# EAGLE design controller (EAGLE 9.1.2)
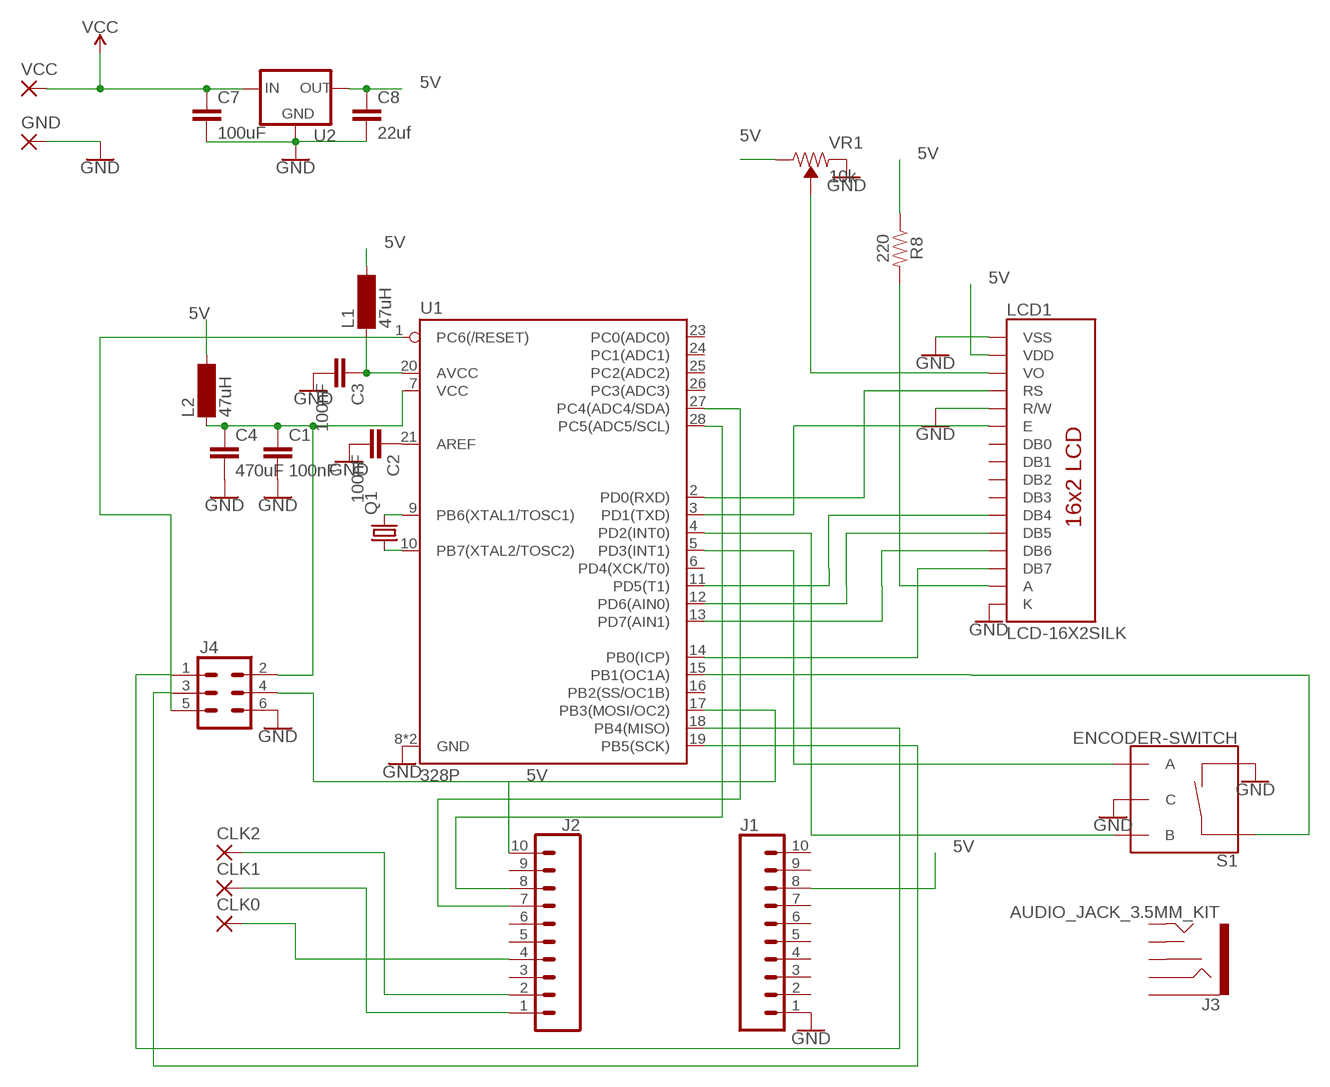
[diagram p0: schematic, sheet 1]

## Parts
C1  100nF  C5/3.5  [C5B3.5]
C2  100nF  C5/3.5  [C5B3.5]
C3  100nF  C5/3.5  [C5B3.5]
C4  470uF  C5/3.5  [C5B3.5]
C7  100uF  C5/3.5  [C5B3.5]
C8  22uf  C5/3.5  [C5B3.5]
CLK0  3,17/1,1  [3,17/1,1]
CLK1  3,17/1,1  [3,17/1,1]
CLK2  3,17/1,1  [3,17/1,1]
GND  3,17/1,1  [3,17/1,1]
J1  CONN_10NO_SILK_PTH_FEMALE  [1X10_NO_SILK]
J2  CONN_10NO_SILK_PTH_FEMALE  [1X10_NO_SILK]
J3  AUDIO_JACK_3.5MM_KIT  [AUDIO-JACK-KIT]
J4  CONN_03X2NO_SILK  [2X3-NS]
L1  47uH  BS75  [BS75]
L2  47uH  BS75  [BS75]
LCD1  LCD-16X2SILK  [LCD-16X2]
Q1  CRYTALHC49S  [HC49/S]
R8  220  1KOHM-HORIZ-1/4W-1%  [AXIAL-0.3]
S1  ENCODER-SWITCH  [ROTARY_ENC_PLAIN]
U1  328P  ATMEGA328P_PDIP  [DIP28]
U2  V_REG_78XXSINK  [TO220-IGO]
VCC  3,17/1,1  [3,17/1,1]
VR1  10k  TRIMPOT-PTH-10MM-KNOB-1/2W-10%  [TRIMPOT-PTH-3386U]

## Nets
5V: C8.1 J1.8 J2.10 L1.2 L2.2 LCD1.2(VDD) R8.P$1 U2.OUT VR1.3(CW)
GND: C1.2 C2.2 C3.2 C4.2 C7.2 C8.2 GND.1(P) J1.1 J4.6 LCD1.1(VSS) LCD1.5(R/W) LCD1.16(K) S1.C S1.SW- U1.8(GND) U1.22(GND) U2.GND VR1.1(CCW)
N$1: C2.1 U1.21(AREF)
N$2: Q1.2 U1.9(PB6(XTAL1/TOSC1))
N$3: Q1.1 U1.10(PB7(XTAL2/TOSC2))
N$4: C1.1 C4.1 J4.2 L2.1 U1.7(VCC)
N$5: LCD1.14(DB7) U1.14(PB0(ICP))
N$6: LCD1.13(DB6) U1.13(PD7(AIN1))
N$7: S1.SW+ U1.15(PB1(OC1A))
N$8: LCD1.4(RS) U1.2(PD0(RXD))
N$9: LCD1.12(DB5) U1.12(PD6(AIN0))
N$10: LCD1.11(DB4) U1.11(PD5(T1))
N$11: LCD1.3(VO) VR1.2(WIPER)
N$12: LCD1.15(A) R8.P$2
N$13: CLK1.1(P) J2.1
N$14: CLK2.1(P) J2.2
N$15: CLK0.1(P) J2.4
N$16: J2.8 U1.28(PC5(ADC5/SCL))
N$17: J2.7 U1.27(PC4(ADC4/SDA))
N$18: S1.A U1.5(PD3(INT1))
N$19: S1.B U1.4(PD2(INT0))
N$20: LCD1.6(E) U1.3(PD1(TXD))
N$21: C3.1 L1.1 U1.20(AVCC)
N$22: J4.4 U1.17(PB3(MOSI/OC2))
N$23: J4.1 U1.18(PB4(MISO))
N$24: J4.3 U1.19(PB5(SCK))
N$25: J4.5 U1.1(PC6(/RESET))
VCC: C7.1 U2.IN VCC.1(P)
Unconnected: J1.2 J1.3 J1.4 J1.5 J1.6 J1.7 J1.9 J1.10 J2.3 J2.5 J2.6 J2.9 J3.RING J3.RSH J3.SLEEVE J3.TIP J3.TSH LCD1.7(DB0) LCD1.8(DB1) LCD1.9(DB2) LCD1.10(DB3) U1.6(PD4(XCK/T0)) U1.16(PB2(SS/OC1B)) U1.23(PC0(ADC0)) U1.24(PC1(ADC1)) U1.25(PC2(ADC2)) U1.26(PC3(ADC3))

## Library data of the parts
C1-C4 C7 C8 = capacitor-wima:C: CAPACITOR naming: grid - package width
CLK0 CLK1 CLK2 GND VCC = wirepad:3,17/1,1: THROUGH-HOLE PAD
J1 J2 = SparkFun-Connectors:CONN_10: Multi connection point. Often used as Generic Header-pin footprint for 0.1 inch spaced/style header connections On any of the 0.1 inch spaced packages, you can populate with these: Break Away Headers - Straight <https://www.sparkfun.com/products/116> (PRT-00116) Break Away Male Headers - Right Angle <https://www.sparkfun.com/products/553> (PRT-00553) Female Headers <https://www.sparkfun.com/products/115> (PRT-00115) Break Away Headers - Machine Pin <https://www.sparkfun.com/products/117> (PRT-00117) Break Away Female Headers - Swiss Machine Pin <https://www.sparkfun.com/products/743> (PRT-00743) Arduino Stackable Header - 10 Pin <https://www.sparkfun.com/products/11376> (PRT-11376) For SCREWTERMINALS and SPRING TERMINALS visit here: Screw Terimnals on SparkFun.com <https://www.sparkfun.com/search/results?term=Screw+Terminals> (5mm/3.5mm/2.54mm spacing) This device is also useful as a general connection point to wire up your design to another part of your project. Our various solder wires solder well into these plated through hole pads. Hook-Up Wire - Assortment (Stranded, 22 AWG) <https://www.sparkfun.com/products/11375> (PRT-11375) Hook-Up Wire - Assortment (Solid Core, 22 AWG) <https://www.sparkfun.com/products/11367> (PRT-11367) View the entire wire category on our website here <https://www.sparkfun.com/categories/141> Special notes: Molex polarized connector foot print use with SKU : PRT-08231 with associated crimp pins and housings. 1MM SMD Version SKU: PRT-10208 NOTES ON THE VARIANTS LOCK and LOCK_LONGPADS... This footprint was designed to help hold the alignment of a through-hole component (i.e. 6-pin header) while soldering it into place. You may notice that each hole has been shifted either up or down by 0.005 of an inch from it's more standard position (which is a perfectly straight line). This slight alteration caused the pins (the squares in the middle) to touch the edges of the holes. Because they are alternating, it causes a "brace" to hold the component in place. 0.005 has proven to be the perfect amount of "off-center" position when using our standard breakaway headers. Although looks a little odd when you look at the bare footprint, once you have a header in there, the alteration is very hard to notice. Also,if you push a header all the way into place, it is covered up entirely on the bottom side.; PROD_ID: CONN-11563
J3 = SparkFun-Connectors:AUDIO_JACK_3.5MM: Audio Jack 3.5mm variants of PTH and SMT stereo audio jack with bypass switches. SparkFun Products: SparkFun SparkPunk Sound Kit <[https://www.sparkfun.com/products/11177]> - PTH MP3 Trigger <https://www.sparkfun.com/products/13720> -3.5mm SMD SparkFun PicoBoard <https://www.sparkfun.com/products/11888>- 2.5mm SMD; PROD_ID: CONN-08774; SF_ID: PRT-08032
J4 = SparkFun-Connectors:CONN_03X2: Multi connection point. Often used as Generic Header-pin footprint for 0.1 inch spaced/style header connections You can populate with any combo of single row headers, but if you'd like an exact match, check these: Header - 2x3 (Male, 0.1") <https://www.sparkfun.com/products/12807> (PRT-12807) Header - 2x3 (Female, 0.1") <https://www.sparkfun.com/products/13010> (PRT-13010) 2x3 Pin Shrouded Header <https://www.sparkfun.com/products/10877> (PRT-10877) On any of the 0.1 inch spaced packages, you can populate with these: Break Away Headers - Straight <https://www.sparkfun.com/products/116> (PRT-00116) Break Away Male Headers - Right Angle <https://www.sparkfun.com/products/553> (PRT-00553) Female Headers <https://www.sparkfun.com/products/115> (PRT-00115) Break Away Headers - Machine Pin <https://www.sparkfun.com/products/117> (PRT-00117) Break Away Female Headers - Swiss Machine Pin <https://www.sparkfun.com/products/743> (PRT-00743) Special note: the shrouded connector mates well with our 3x2 ribbon cables: Ribbon Crimp Connector - 6-pin (2x3, Female) <https://www.sparkfun.com/products/10651> (PRT-10651) Ribbon Cable - 6 wire (15ft) <https://www.sparkfun.com/products/10646> (PRT-10646)
L1 L2 = inductor-neosid:BS: INDUCTOR nominal inductance, magnetically screened; OC_FARNELL: unknown; OC_NEWARK: unknown
LCD1 = SparkFun-Displays:LCD-16X2: Standard text-only 16x2 parallel input LCD Basic 16 character by 2 line display. Typically utilizes the extremely common HD44780 parallel interface chipset SparkFun Products: Basic 16x2 Green <https://www.sparkfun.com/products/255> Basic 8x2 Green <https://www.sparkfun.com/products/11122>; SF_ID: LCD-00255
Q1 = crystal:CRYTAL: CRYSTAL
R8 = SparkFun-Resistors:1KOHM: 1kΩ resistor A resistor is a passive two-terminal electrical component that implements electrical resistance as a circuit element. Resistors act to reduce current flow, and, at the same time, act to lower voltage levels within circuits. - Wikipedia; PROD_ID: RES-12182; VALUE: 1k
S1 = SparkFun-Switches:ENCODER-SWITCH: Rotary Encoder w/ Select Switch Encoders rotate similarly to potentiometers, but they’re different from potentiometers in that an encoder has full rotation without limits. They output gray code so that you can tell how much and in which direction the encoder has been turned. This encoder includes a push-down select switch built into the shaft. SparkFun Products Rotary Encoder <https://www.sparkfun.com/products/9117> (COM-09117); SF_SKU: COM-09117
U1 = SparkFun-IC-Microcontroller:ATMEGA328P_PDIP: Atmel 328P Through hole ATMEGA328P uC used in the Arduino 32kb flash, 1k EEPROM, 2k SRAM Datasheet <http://www.sparkfun.com/datasheets/Components/SMD/ATMega328.pdf> SparkFun Products Storefront component: AVR 28 Pin 20MHz 32K 6A/D - ATMega328P <https://www.sparkfun.com/products/9061> (COM-09061) SparkFun Simon Says - Through-Hole Soldering Kit <https://www.sparkfun.com/products/10547> (KIT-10547) SparkFun Learn to Solder - Simon Says <https://www.sparkfun.com/products/13708> (KIT-13708) SparkFun BigTime Watch Kit <https://www.sparkfun.com/products/11734> (KIT-11734) SparkFun ClockIt <https://www.sparkfun.com/products/10930> (KIT-10930) SparkFun Serial Enabled LCD Kit <https://www.sparkfun.com/products/10097> (LCD-10097) SparkFun Simon Tilts - Through Hole Soldering Kit <https://www.sparkfun.com/products/12634> (KIT-12634) SparkFun Frequency Counter Kit <https://www.sparkfun.com/products/10140> (KIT-10140) FabFM Radio Kit <https://www.sparkfun.com/products/11043> (KIT-11043) SparkFun Binary Blaster Kit <https://www.sparkfun.com/products/12037> (KIT-12037) SparkFun Metro-Gnome <https://www.sparkfun.com/products/9236> (KIT-09236) ATmega328 with Arduino Optiboot (Uno) <https://www.sparkfun.com/products/10524> (DEV-10524); PROD_ID: IC-09136
U2 = SparkFun-IC-Power:V_REG_78XX: Voltage Regulator Standard 78xx regulator. IGO (Input Ground Output). Spark Fun Electronics SKU : COM-00107
VR1 = SparkFun-Resistors:TRIMPOT: Trimming Potentiometer (Trimpot) Three-terminal potentiometers, with an adjustable wiper and two adjustable resistors. A pot can be used to create a configurable voltage divider, or as a variable resistor. "Trimpots" are a subset of potentiometers, usually intended for "set-and-forget" applications. They're often more delicate than standard potentiometers - rated for fewer turns. Variants PTH-KNOB - PTH Trimpot w/ finger-adjustable knob Trimpot 10K with Knob <https://www.sparkfun.com/products/9806> (COM-09806) Datasheet <http://www.sparkfun.com/datasheets/Components/General/TSR-3386.pdf> SMD-3MM-CLOSED-FRAME - SMD 3mm Square Closed-Frame Trimpot Used on e.g. EasyDriver - Stepper Motor Driver <https://www.sparkfun.com/products/12779> Datasheet <http://www.bitechnologies.com/pdfs/22.pdf> (22AR10KTR) SMD-5MM - SMD 5mm Square Closed-Frame Trimpot Used on e.g. IOIO-OTG - V2.2 <https://www.sparkfun.com/products/13613> Datasheet <http://www.vishay.com/docs/51008/ts53.pdf> (TS53YL502MR10) SMD-3MM-1/10W-25% - 3mm Square Open-Frame Trimpot Used on e.g. SparkFun Shapeoko <https://www.sparkfun.com/products/13899> Datasheet <http://www.bourns.com/docs/Product-Datasheets/TC33.pdf> (TC33X-2-103E); PROD_ID: RES-09730; SF_SKU: COM-09806

## Net classes
0 default: width 0.762 mm, drill 0.762 mm, clearance 0.508 mm

## Board
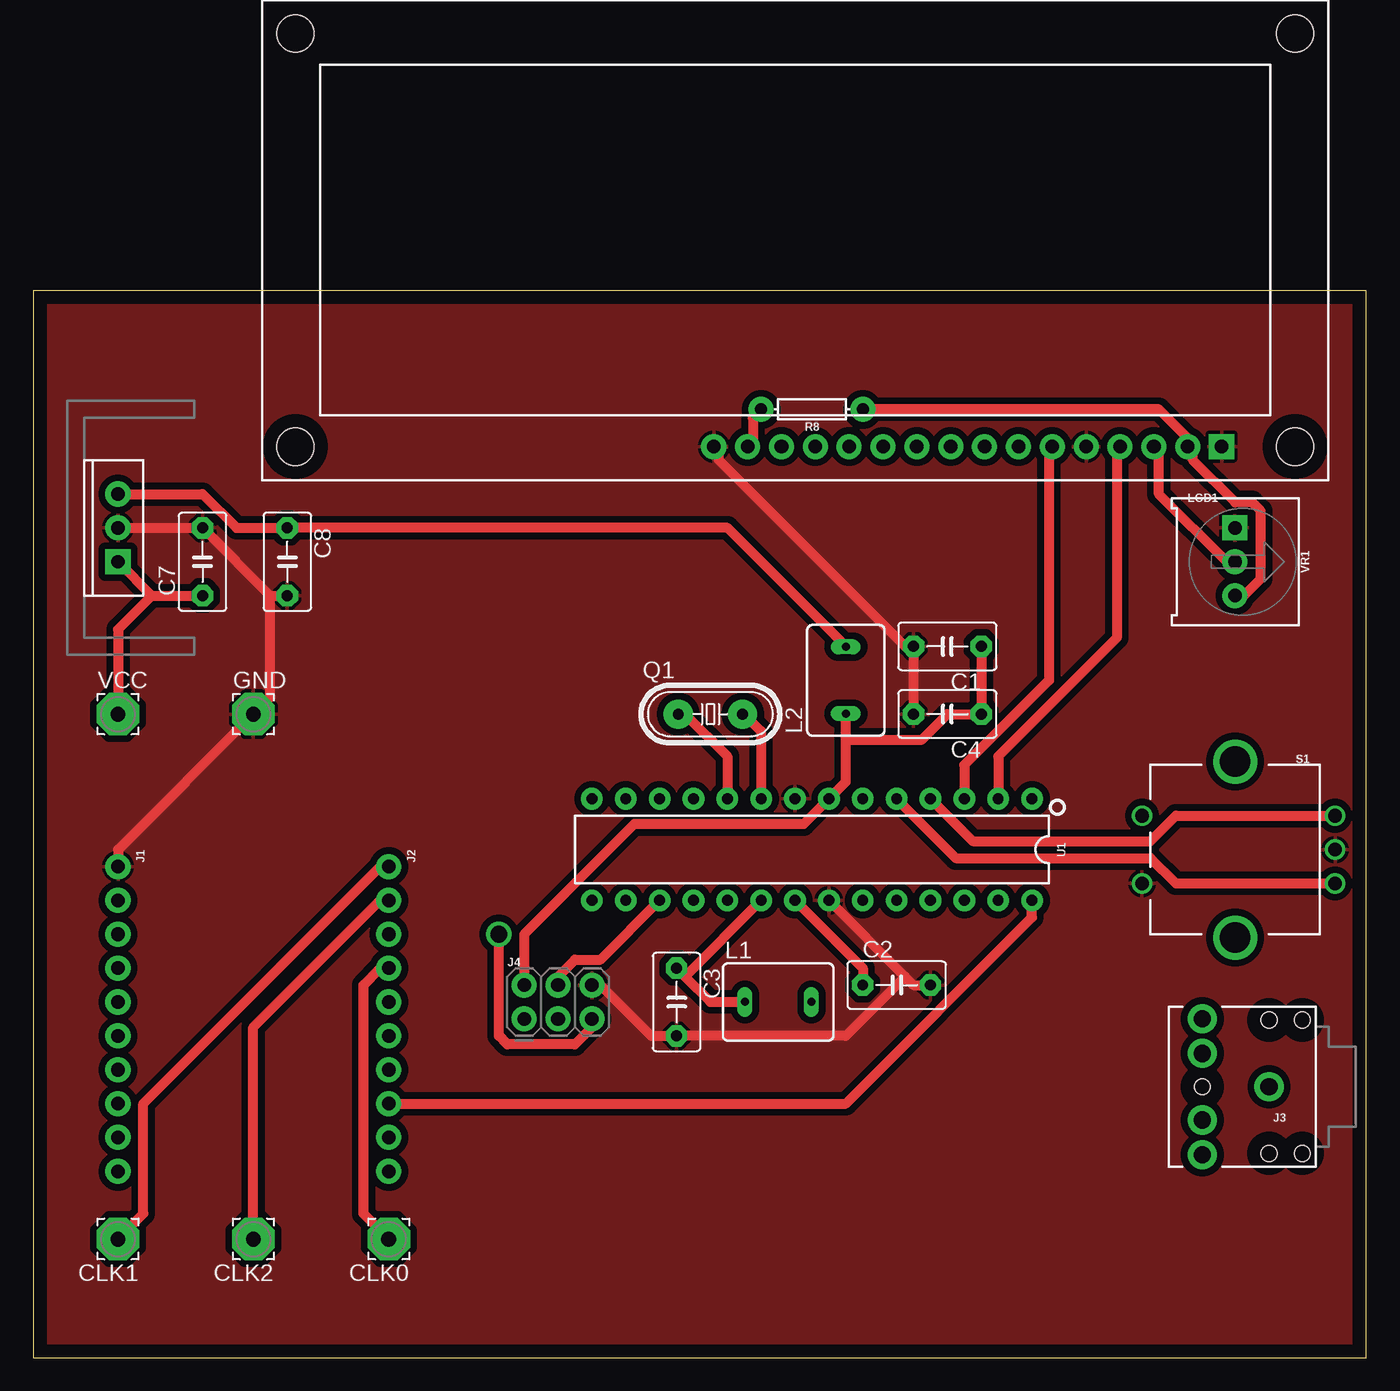
[diagram p1: board, top side]
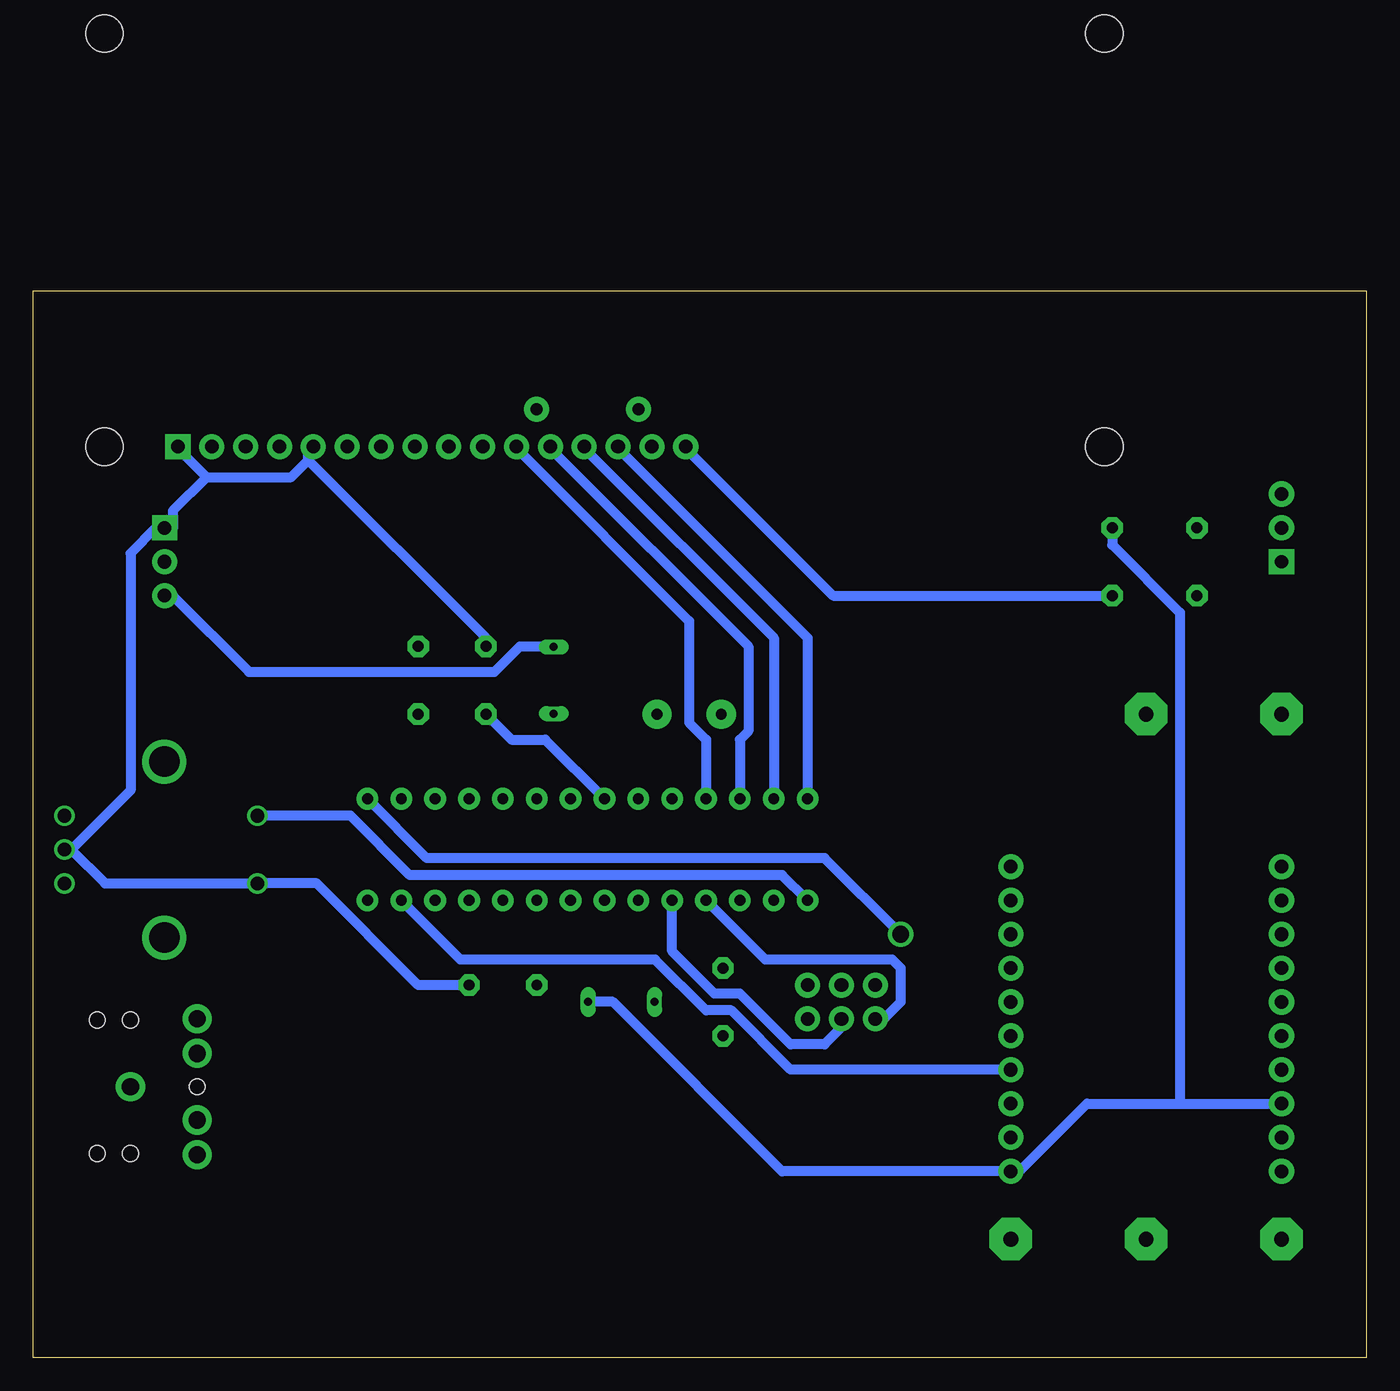
[diagram p2: board, bottom side, seen from below]

Size 100 x 80 mm. Coordinates in mm from the lower left corner, seen from the top.
Outline: 0,0 100,0 100,80 0,80 0,0
Copper layers (1*16): Top 0.035mm / dielectric 1.5mm / Bottom 0.035mm
Design rules "default": minimum track width 6mil, minimum drill 0.35mm, track to track 6mil, track to pad 6mil, pad to pad 6mil, via to via 6mil, smd to smd 6mil, copper to edge 40mil, drill to drill 6mil, minimum pad ring 10mil, minimum via ring 8mil, stop-mask expansion 4mil, vias tented up to drill 0mil, thermal gap 10mil

### Footprints (pad centres in the part's own frame; a part is rotated, then mirrored left to right if it is on the bottom)
C5B3.5 = drill 0.813 pad 1.6 octagon: 1 -2.54,0; 2 2.54,0
3,17/1,1 = drill 1.118 pad 3.175 octagon: 1 0,0
1X10_NO_SILK = drill 1.016 pad 1.88: 1 0,0; 2 2.54,0; 3 5.08,0; 4 7.62,0; 5 10.16,0; 6 12.7,0; 7 15.24,0; 8 17.78,0; 9 20.32,0; 10 22.86,0
AUDIO-JACK-KIT = drill 1.3 pad 2.184: RING 5,5.1; RSH 5,2.5; SLEEVE 0,0; TIP 5,-5.1; TSH 5,-2.5 | hole 1.2: 0,5; -2.5,5; -2.5,-5; 0,-5; 5,0
2X3-NS = drill 1.016 pad 1.88: 1 -2.54,-1.27; 2 -2.54,1.27; 3 0,-1.27; 4 0,1.27; 5 2.54,-1.27; 6 2.54,1.27
BS75 = drill 0.6 long: 1 -2.5,0; 2 2.5,0
LCD-16X2 = drill 1.016 pad 1.88 square: 1 -32,15.5 | drill 1.016 pad 1.88: 2 -29.46,15.5; 3 -26.92,15.5; 4 -24.38,15.5; 5 -21.84,15.5; 6 -19.3,15.5; 7 -16.76,15.5; 8 -14.22,15.5; 9 -11.68,15.5; 10 -9.14,15.5; 11 -6.6,15.5; 12 -4.06,15.5; 13 -1.52,15.5; 14 1.02,15.5; 15 3.56,15.5; 16 6.1,15.5 | hole 2.8: -37.5,15.5; -37.5,-15.5; 37.5,15.5; 37.5,-15.5
HC49/S = drill 0.813 pad 2.184: 1 -2.413,0; 2 2.413,0
AXIAL-0.3 = drill 0.9 pad 1.88: P$1 -3.81,0; P$2 3.81,0
ROTARY_ENC_PLAIN = drill 1.016: A 7.493,-2.54; B 7.493,2.54; C 7.493,0; SW+ -6.985,2.54; SW- -6.985,-2.54 | drill 2.286: P$3 0,6.604; P$4 0,-6.604
DIP28 = drill 0.813 pad 1.626: 1 -16.51,-3.81; 2 -13.97,-3.81; 3 -11.43,-3.81; 4 -8.89,-3.81; 5 -6.35,-3.81; 6 -3.81,-3.81; 7 -1.27,-3.81; 8 1.27,-3.81; 9 3.81,-3.81; 10 6.35,-3.81; 11 8.89,-3.81; 12 11.43,-3.81; 13 13.97,-3.81; 14 16.51,-3.81; 15 16.51,3.81; 16 13.97,3.81; 17 11.43,3.81; 18 8.89,3.81; 19 6.35,3.81; 20 3.81,3.81; 21 1.27,3.81; 22 -1.27,3.81; 23 -3.81,3.81; 24 -6.35,3.81; 25 -8.89,3.81; 26 -11.43,3.81; 27 -13.97,3.81; 28 -16.51,3.81
TO220-IGO = drill 1 pad 1.88: GND 0,0; OUT 2.54,0 | drill 1 pad 1.88 square: IN -2.54,0
TRIMPOT-PTH-3386U = drill 1.016 pad 1.88 square: 1 -2.54,-0.015 | drill 1.016 pad 1.88: 2 0,-0.015; 3 2.54,-0.015

### Placement (x,y rotation side)
C1  68.58,53.34 180 top
C2  64.77,27.94 0 top
C3  48.26,26.67 270 top
C4  68.58,48.26 180 top
C7  12.7,59.69 90 top
C8  19.05,59.69 270 top
CLK0  26.67,8.89 180 top
CLK1  6.35,8.89 180 top
CLK2  16.51,8.89 180 top
GND  16.51,48.26 0 top
J1  6.35,36.83 270 top
J2  26.67,36.83 270 top
J3  92.71,20.32 180 top
J4  39.37,26.67 0 top
L1  55.88,26.67 0 top
L2  60.96,50.8 90 top
LCD1  57.15,83.82 180 top
Q1  50.8,48.26 0 top
R8  58.42,71.12 180 top
S1  90.17,38.1 0 top
U1  58.42,38.1 180 top
U2  6.35,62.23 90 top
VCC  6.35,48.26 0 top
VR1  90.17,59.69 270 top

### Tracks (layer width: path | path; a pad name or v marks a point on that pad's centre or on a via)
5V
  Top 0.762: U2.OUT 12.7,64.77 15.24,62.23 C8.1 52.07,62.23 60.96,53.34 L2.2 | VR1.3 90.81,57.15 92.08,58.42 92.08,63.5 91.44,64.14 90.17,64.14 87,67.31 87,67.94 LCD1.2 87,68.58 84.45,71.12 R8.P$1
  Bottom 0.762: L1.2 56.52,26.67 43.81,13.97 J2.10 26.04,13.97 20.95,19.05 13.97,19.05 | L1.2 58.42,26.67 L1.2 | 13.97,19.05 J1.8 | L2.2 60.96,53.34 63.5,53.34 65.41,51.44 83.82,51.44 89.53,57.15 VR1.3 | 13.97,19.05 13.97,55.88 19.05,60.96 C8.1
GND
  Top 0.762: J4.6 42.55,27.94 46.35,24.13 C3.2 60.96,24.13 65.41,28.57 | C2.2 66.04,27.94 65.41,28.57 | U1.22 65.41,28.57 | U2.GND C7.2 17.78,57.15 | 17.78,57.15 C8.2 | J1.1 6.35,38.1 GND.1 17.78,49.53 17.78,57.15 | 66.04,52.7 C1.2 66.04,52.7 | 66.04,52.7 C4.2 | 66.04,52.7 51.44,67.31 51.44,67.94 LCD1.16
  Bottom 0.762: 97.16,38.1 94.61,35.56 S1.SW- 78.74,35.56 71.12,27.94 C2.2 | 97.16,38.1 S1.C 97.16,38.1 | 79.38,67.31 79.38,67.94 LCD1.5 | 79.38,67.31 80.64,66.04 87,66.04 | 87,66.04 88.9,67.94 LCD1.1 | 87,66.04 89.53,63.5 89.53,62.23 VR1.1 90.81,62.23 92.71,60.33 92.71,42.55 97.16,38.1 | U1.8 61.59,46.35 64.14,46.35 C4.2 | 79.38,67.31 66.04,53.98 C1.2 | C8.2 40.01,57.15 50.8,67.94 LCD1.16
  pour Top: 0,80.01 100.33,80.01 100.33,0 0,0
N$1
  Top 0.762: C2.1 62.23,29.21 U1.21
N$2
  Top 0.762: U1.9 54.61,46.99 53.34,48.26 Q1.2
N$3
  Top 0.762: U1.10 52.07,45.09 48.9,48.26 Q1.1
N$4
  Top 0.762: C1.1 C4.1 68.58,48.26 66.67,46.35 60.96,46.35 | 60.96,46.35 60.96,43.18 U1.7 57.78,40.01 45.09,40.01 36.83,31.75 J4.2 | 60.96,46.35 60.96,48.26 L2.1
N$5
  Bottom 0.762: U1.14 41.91,53.98 55.88,67.94 LCD1.14
N$6
  Bottom 0.762: U1.13 44.45,53.98 58.42,67.94 LCD1.13
N$7
  Bottom 0.762: S1.SW+ 76.2,40.64 71.75,36.2 43.81,36.2 U1.15
N$8
  Top 0.762: U1.2 72.39,45.09 81.28,53.98 81.28,67.94 LCD1.4
N$9
  Bottom 0.762: U1.12 46.99,46.35 46.35,46.99 46.35,53.34 60.96,67.94 LCD1.12
N$10
  Bottom 0.762: U1.11 49.53,46.35 50.8,47.62 50.8,55.24 63.5,67.94 LCD1.11
N$11
  Top 0.762: LCD1.3 84.45,67.94 84.45,64.77 89.53,59.69 VR1.2
N$12
  Top 0.762: R8.P$2 53.98,70.48 53.98,68.58 LCD1.15
N$13
  Top 0.762: J2.1 26.04,36.83 8.26,19.05 8.26,10.79 CLK1.1
N$14
  Top 0.762: J2.2 26.04,34.29 16.51,24.77 CLK2.1
N$15
  Top 0.762: J2.4 26.04,29.21 24.77,27.94 24.77,10.79 CLK0.1
N$16
  Top 0.762: U1.28 74.93,33.02 60.96,19.05 J2.8
N$17
  Bottom 0.762: U1.27 67.94,29.84 53.34,29.84 49.53,26.04 47.62,26.04 43.18,21.59 J2.7
N$18
  Top 0.762: U1.5 69.22,37.47 83.82,37.47 85.72,35.56 97.16,35.56 S1.A
N$19
  Top 0.762: U1.4 70.48,38.73 83.82,38.73 85.72,40.64 97.16,40.64 S1.B
N$20
  Top 0.762: U1.3 69.85,44.45 76.2,50.8 76.2,67.94 LCD1.6
N$21
  Top 0.762: C3.1 48.9,28.57 | 48.9,28.57 50.8,26.67 53.34,26.67 L1.1 | 48.9,28.57 U1.20
N$22
  Top 0.762: U1.17 42.55,29.84 40.64,29.84 39.37,28.57 J4.4
N$23
  Bottom 0.762: U1.18 45.09,29.84 35.56,29.84 34.92,29.21 34.92,26.67 36.2,25.4 J4.1
N$24
  Bottom 0.762: U1.19 52.07,30.48 48.9,27.3 46.99,27.3 43.18,23.5 40.64,23.5 39.37,24.77 J4.3
N$25  (via drill 1.27)
  Top 0.762: v34.92,31.75 34.92,24.13 35.56,23.5 40.64,23.5 41.91,24.77 J4.5
  Bottom 0.762: U1.1 70.48,37.47 40.64,37.47 v34.92,31.75
VCC
  Top 0.762: 8.89,57.15 C7.1 | U2.IN 8.89,57.15 | VCC.1 6.35,54.61 8.89,57.15